# EAGLE design OV5640af (EAGLE 9.7.0)
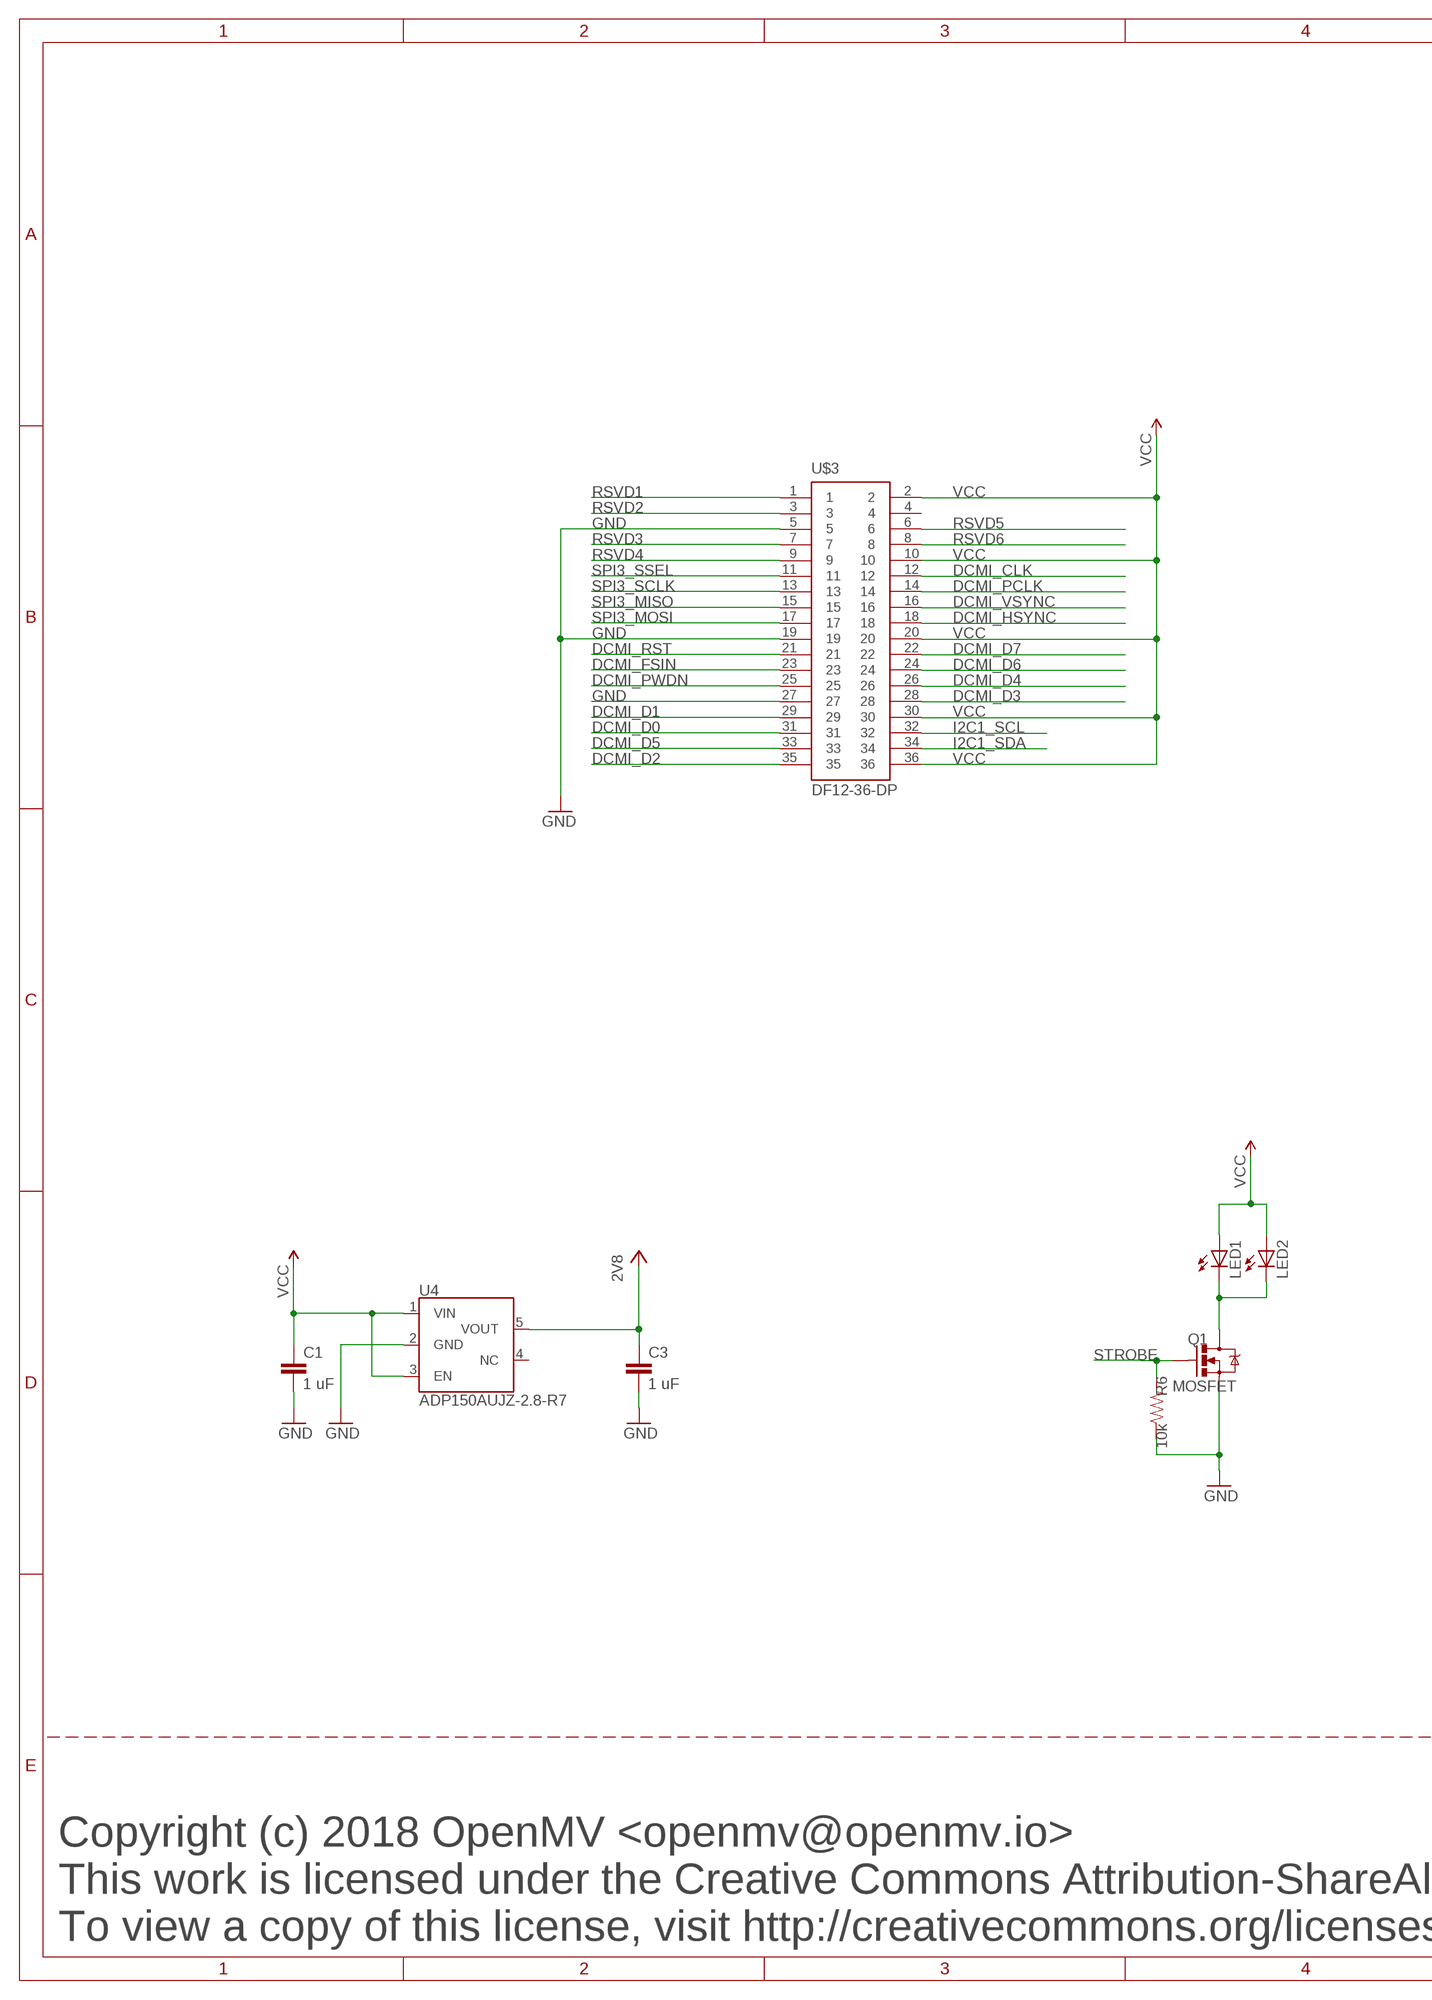
[diagram p0: schematic, sheet 1, part 1 of 2]
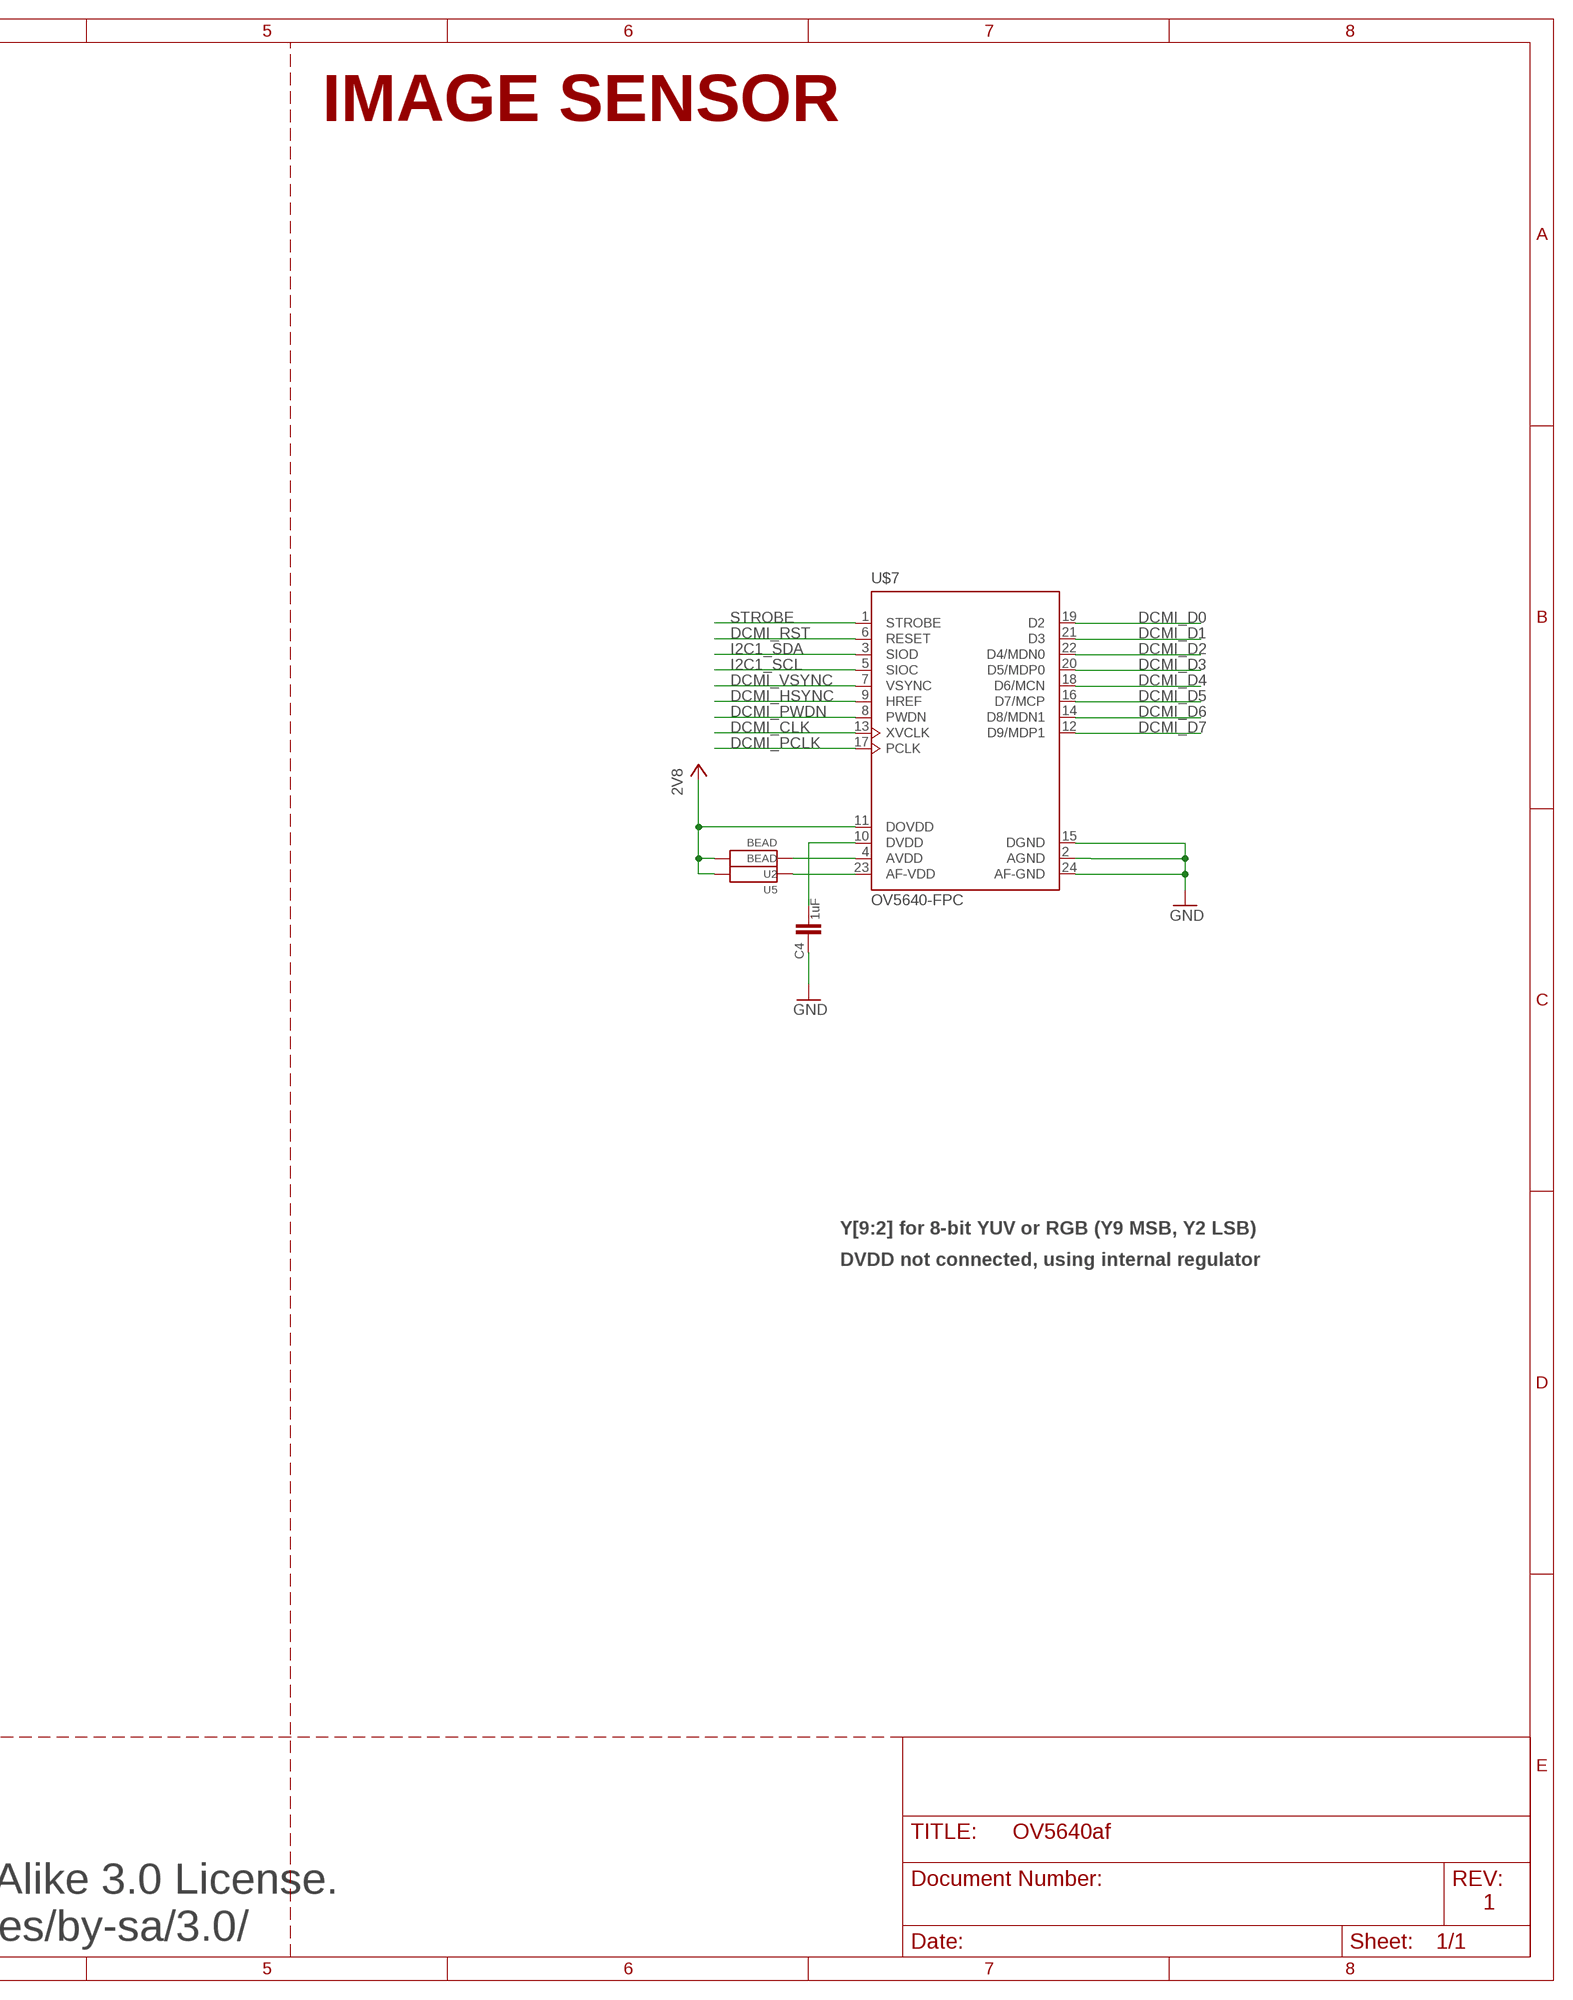
[diagram p1: schematic, sheet 1, part 2 of 2]

## Parts
C1  1 uF  CAP0402-CAP  [0402-CAP]
C3  1 uF  CAP0402-CAP  [0402-CAP]
C4  1uF  CAP0402-CAP  [0402-CAP]
LED1  LEDCHIPLED_1206  [CHIPLED_1206]
LED2  LEDCHIPLED_1206  [CHIPLED_1206]
Q1  MOSFET  MOSFET-NCHANNELSMD  [SOT23-3]
R6  10k  RESISTOR0603-RES  [0603-RES]
U2  BEAD  [0402-CAP]
U4  ADP150AUJZ-2.8-R7  ADP150TSOT-5  [SOT23-5]
U5  BEAD  [0402-CAP]
U$3  DF12-36-DP  [DF12-36-DP]
U$7  OV5640-FPC  [FPC24]

## Nets
2V8: C3.1 U2.2 U4.5(VOUT) U5.2 U$7.11(DOVDD)
AF-VDD: U5.1 U$7.23(AF-VDD)
AVDD: U2.1 U$7.4(AVDD)
DCMI_CLK: U$3.12 U$7.13(XVCLK)
DCMI_D0: U$3.31 U$7.19(D2)
DCMI_D1: U$3.29 U$7.21(D3)
DCMI_D2: U$3.35 U$7.22(D4/MDN0)
DCMI_D3: U$3.28 U$7.20(D5/MDP0)
DCMI_D4: U$3.26 U$7.18(D6/MCN)
DCMI_D5: U$3.33 U$7.16(D7/MCP)
DCMI_D6: U$3.24 U$7.14(D8/MDN1)
DCMI_D7: U$3.22 U$7.12(D9/MDP1)
DCMI_FSIN: U$3.23
DCMI_HSYNC: U$3.18 U$7.9(HREF)
DCMI_PCLK: U$3.14 U$7.17(PCLK)
DCMI_PWDN: U$3.25 U$7.8(PWDN)
DCMI_RST: U$3.21 U$7.6(RESET)
DCMI_VSYNC: U$3.16 U$7.7(VSYNC)
DVDD: C4.1 U$7.10(DVDD)
GND: C1.2 C3.2 C4.2 Q1.2(S) R6.1 U4.2(GND) U$3.5 U$3.19 U$3.27 U$7.2(AGND) U$7.15(DGND) U$7.24(AF-GND)
I2C1_SCL: U$3.32 U$7.5(SIOC)
I2C1_SDA: U$3.34 U$7.3(SIOD)
LEDK: LED1.C LED2.C Q1.3(D)
RSVD1: U$3.1
RSVD2: U$3.3
RSVD3: U$3.7
RSVD4: U$3.9
RSVD5: U$3.6
RSVD6: U$3.8
SPI3_MISO: U$3.15
SPI3_MOSI: U$3.17
SPI3_SCLK: U$3.13
SPI3_SSEL: U$3.11
STROBE: Q1.1(G) R6.2 U$7.1(STROBE)
VCC: C1.1 LED1.A LED2.A U4.1(VIN) U4.3(EN) U$3.2 U$3.10 U$3.20 U$3.30 U$3.36
Unconnected: U4.4(NC) U$3.4

## Notes on the sheet
- IMAGE SENSOR
- Y[9:2] for 8-bit YUV or RGB (Y9 MSB, Y2 LSB)
- DVDD not connected, using internal regulator
- Copyright (c) 2018 OpenMV <openmv@openmv.io>
- This work is licensed under the Creative Commons Attribution-ShareAlike 3.0 License.
- 1
- To view a copy of this license, visit http://creativecommons.org/licenses/by-sa/3.0/

## Library data of the parts
C1 C3 = SparkFun-Capacitors:CAP: Capacitor Standard 0603 ceramic capacitor, and 0.1" leaded capacitor.
C4 = sfe:CAP: Capacitor Standard 0603 ceramic capacitor, and 0.1" leaded capacitor.
LED1 LED2 = led:LED: LED OSRAM: - CHIPLED LG R971, LG N971, LY N971, LG Q971, LY Q971, LO R971, LY R971 LH N974, LH R974 LS Q976, LO Q976, LY Q976 LO Q996 - Hyper CHIPLED LW Q18S LB Q993, LB Q99A, LB R99A - SideLED LS A670, LO A670, LY A670, LG A670, LP A670 LB A673, LV A673, LT A673, LW A673 LH A674 LY A675 LS A676, LA A676, LO A676, LY A676, LW A676 LS A679, LY A679, LG A679 - Hyper Micro SIDELED® LS Y876, LA Y876, LO Y876, LY Y876 LT Y87S - SmartLED LW L88C, LW L88S LB L89C, LB L89S, LG L890 LS L89K, LO L89K, LY L89K LS L896, LA L896, LO L896, LY L896 - TOPLED LS T670, LO T670, LY T670, LG T670, LP T670 LSG T670, LSP T670, LSY T670, LOP T670, LYG T670 LG T671, LOG T671, LSG T671 LB T673, LV T673, LT T673, LW T673 LH T674 LS T676, LA T676, LO T676, LY T676, LB T676, LH T676, LSB T676, LW T676 LB T67C, LV T67C, LT T67C, LS T67K, LO T67K, LY T67K, LW E67C LS E67B, LA E67B, LO E67B, LY E67B, LB E67C, LV E67C, LT E67C LW T67C LS T679, LY T679, LG T679 LS T770, LO T770, LY T770, LG T770, LP T770 LB T773, LV T773, LT T773, LW T773 LH T774 LS E675, LA E675, LY E675, LS T675 LS T776, LA T776, LO T776, LY T776, LB T776 LHGB T686 LT T68C, LB T68C - Hyper Mini TOPLED® LB M676 - Mini TOPLED Santana® LG M470 LS M47K, LO M47K, LY M47K Source: http://www.osram.convergy.de LUXEON: - LUMILED® LXK2-PW12-R00, LXK2-PW12-S00, LXK2-PW14-U00, LXK2-PW14-V00 LXK2-PM12-R00, LXK2-PM12-S00, LXK2-PM14-U00 LXK2-PE12-Q00, LXK2-PE12-R00, LXK2-PE12-S00, LXK2-PE14-T00, LXK2-PE14-U00 LXK2-PB12-K00, LXK2-PB12-L00, LXK2-PB12-M00, LXK2-PB14-N00, LXK2-PB14-P00, LXK2-PB14-Q00 LXK2-PR12-L00, LXK2-PR12-M00, LXK2-PR14-Q00, LXK2-PR14-R00 LXK2-PD12-Q00, LXK2-PD12-R00, LXK2-PD12-S00 LXK2-PH12-R00, LXK2-PH12-S00 LXK2-PL12-P00, LXK2-PL12-Q00, LXK2-PL12-R00 Source: www.luxeon.com KINGBRIGHT: KA-3528ASYC Source: www.kingbright.com
Q1 = sfe:MOSFET-NCHANNEL
R6 = sfe:RESISTOR: Resistor Basic schematic elements and footprints for 0603, 1206, and PTH resistors.
U2 U5 = heka:BEAD
U4 = leptonCustom:ADP150: ADP150 2.8V 150mA Linear LDO Regulator Analog Devices ADP150AUJZ-2.8-R7
U$3 = DF12:DF12-36-DP
U$7 = ov5640:OV5640-FPC

## Net classes
0 default: width 0.127 mm

## Board
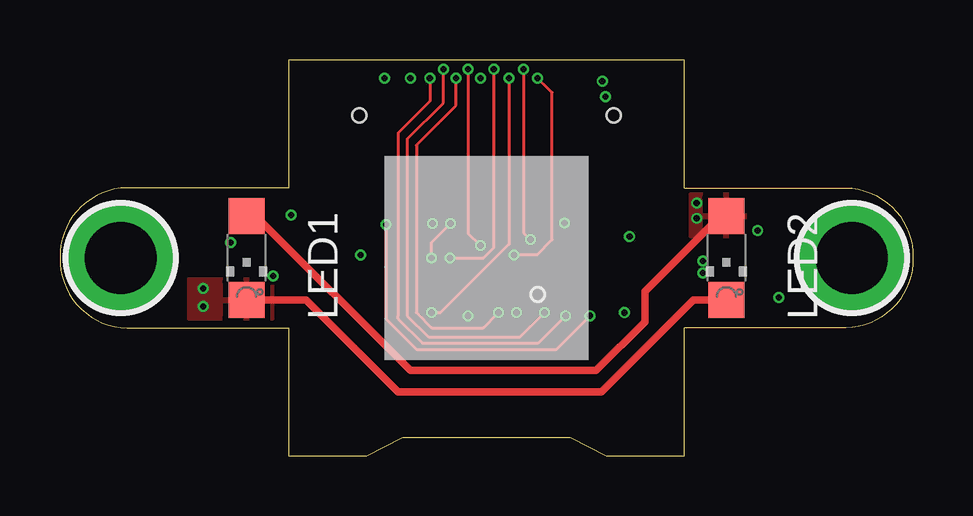
[diagram p2: board, top side]
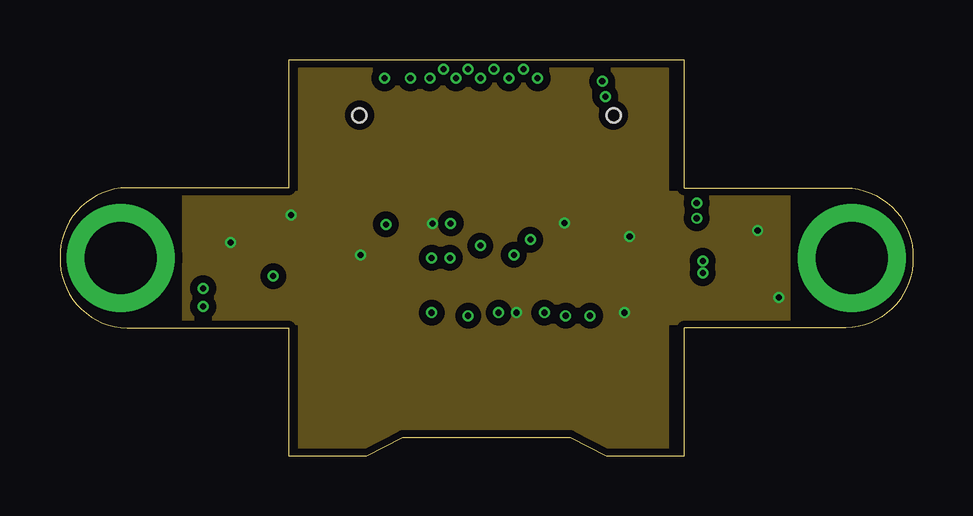
[diagram p3: board, inner layer GND]
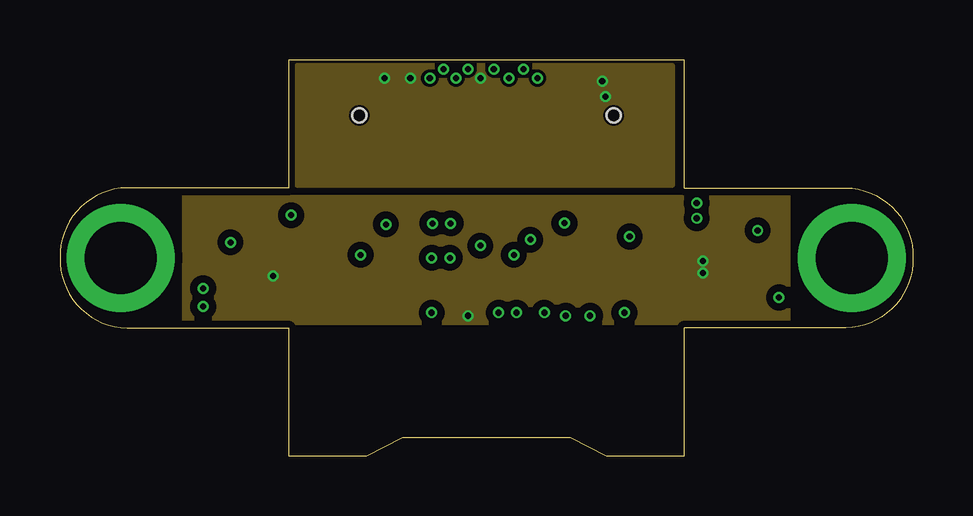
[diagram p4: board, inner layer VCC]
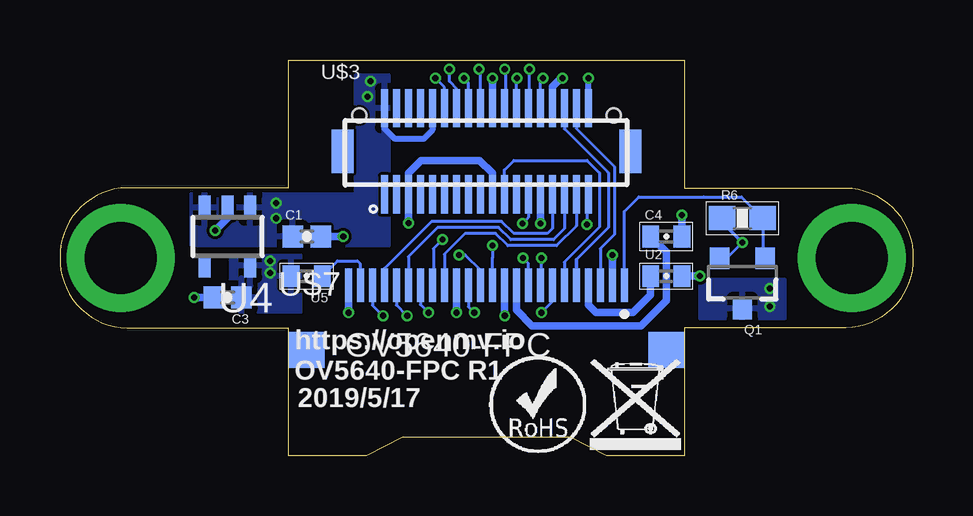
[diagram p5: board, bottom side, seen from below]

Size 35.56 x 16.51 mm. Coordinates in mm from the lower left corner, seen from the top.
Outline: 9.53,16.51 9.53,11.18 2.79,11.18 arc90 0,8.26 arc90 2.79,5.33 9.53,5.33 9.53,0 12.78,0 14.28,0.76 21.28,0.76 22.78,0 26.04,0 26.04,5.33 32.77,5.33 arc90 35.56,8.26 arc90 32.77,11.18 26.04,11.18 26.04,16.51 9.53,16.51
Copper layers (1*2+15*16): Top 0.035mm / dielectric 1.5mm / GND 0.035mm / dielectric 0.15mm / VCC 0.035mm / dielectric 0.2mm / Bottom 0.035mm
Design rules "default *": minimum track width 4mil, minimum drill 10mil, track to track 5mil, track to pad 5mil, pad to pad 5mil, via to via 5mil, smd to smd 5mil, copper to edge 5mil, drill to drill 10mil, minimum pad ring 10mil, minimum via ring 4mil, stop-mask expansion 2mil, vias tented up to drill 30mil, thermal gap 10mil

### Footprints (pad centres in the part's own frame; a part is rotated, then mirrored left to right if it is on the bottom)
0402-CAP = smd 0.85 x 0.9: 1 -0.58,0; 2 0.58,0
0402-CAP' = smd 0.7 x 0.9: 1 -0.65,0; 2 0.65,0
CHIPLED_1206 = smd 1.5 x 1.5: A 0,-1.75; C 0,1.75
SOT23-3 = smd 0.8 x 0.9: 1 -0.95,-1; 2 0.95,-1; 3 0,1.1
0603-RES = smd 1.1 x 1: 1 -0.85,0; 2 0.85,0
SOT23-5 = smd 0.5 x 1: 1 -0.95,-1.2; 2 0,-1.2; 3 0.95,-1.2; 4 0.95,1.2; 5 -0.95,1.2
DF12-36-DP = smd 0.3 x 1.6: 1 -4.25,-1.8; 2 -4.25,1.8; 3 -3.75,-1.8; 4 -3.75,1.8; 5 -3.25,-1.8; 6 -3.25,1.8; 7 -2.75,-1.8; 8 -2.75,1.8; 9 -2.25,-1.8; 10 -2.25,1.8; 11 -1.75,-1.8; 12 -1.75,1.8; 13 -1.25,-1.8; 14 -1.25,1.8; 15 -0.75,-1.8; 16 -0.75,1.8; 17 -0.25,-1.8; 18 -0.25,1.8; 19 0.25,-1.8; 20 0.25,1.8; 21 0.75,-1.8; 22 0.75,1.8; 23 1.25,-1.8; 24 1.25,1.8; 25 1.75,-1.8; 26 1.75,1.8; 27 2.25,-1.8; 28 2.25,1.8; 29 2.75,-1.8; 30 2.75,1.8; 31 3.25,-1.8; 32 3.25,1.8; 33 3.75,-1.8; 34 3.75,1.8; 35 4.25,-1.8; 36 4.25,1.8 | smd 0.9 x 1.8: F1 -6,0; F2 6,0 | hole 0.6: -5.3,1.5; 5.3,1.5
FPC24 = smd 0.3 x 1.4: 1 -5.75,0; 2 -5.25,0; 3 -4.75,0; 4 -4.25,0; 5 -3.75,0; 6 -3.25,0; 7 -2.75,0; 8 -2.25,0; 9 -1.75,0; 10 -1.25,0; 11 -0.75,0; 12 -0.25,0; 13 0.25,0; 14 0.75,0; 15 1.25,0; 16 1.75,0; 17 2.25,0; 18 2.75,0; 19 3.25,0; 20 3.75,0; 21 4.25,0; 22 4.75,0; 23 5.25,0; 24 5.75,0 | smd 1.5 x 1.5: PAD1 -7.5,2.7; PAD2 7.5,2.7

### Placement (x,y rotation side)
C1  25.27,9.14 0 bottom
C3  28.58,6.6 180 bottom
C4  1uF  [0402-CAP']  10.29,9.14 0 bottom
LED1  7.78,8.26 180 top
LED2  27.78,8.26 180 top
Q1  7.11,7.24 180 bottom
R6  7.11,9.91 0 bottom
U2  BEAD  [0402-CAP']  10.29,7.49 0 bottom
U4  28.58,9.14 180 bottom
U5  BEAD  [0402-CAP']  25.27,7.49 180 bottom
U$1  [WEEE]  13.46,0.25 0 bottom
U$2  [ROHS]  17.65,0.13 0 bottom
U$3  17.78,12.7 0 bottom
U$7  17.78,7.11 180 bottom

### Tracks (layer width: path | path; a pad name or v marks a point on that pad's centre or on a via)
2V8  (via drill 0.25)
  Bottom 0.127: 17.03,5.85 v17.02,5.84
  Bottom 0.305: U$7.11 17.03,5.85 | U2.2 v8.89,7.49
  other vias: 26.8,7.62 26.8,8.13
  pour VCC (isolate 0.305, rank 2): 5.21,5.59 30.35,5.59 30.35,10.92 5.21,10.92
  pour Bottom: 25.53,5.97 28.45,5.97 28.45,8.38 25.53,8.38
AF-VDD
  Bottom 0.127: U$7.23 23.03,8 23.16,8.13 23.99,8.13 U5.1
AVDD
  Bottom 0.127: 11.68,5.97 10.94,6.72
  Bottom 0.305: U$7.4 13.53,6.29 13.21,5.97 11.68,5.97 10.94,6.72 U2.1
DCMI_CLK  (via drill 0.25)
  Top 0.127: v18.92,8.38 19.88,8.38 20.51,9.02 20.51,15.15 v19.91,15.75
  Bottom 0.127: U$7.13 18.03,7.74 18.67,8.38 v18.92,8.38 | U$3.12 19.53,15.36 v19.91,15.75
DCMI_D0
  Bottom 0.127: U$3.31 14.53,9.47 14.99,9.02 16.76,9.02 17.27,9.53 19.81,9.53 21.03,8.31 U$7.19
DCMI_D1
  Bottom 0.127: U$3.29 15.03,9.48 15.24,9.27 16.64,9.27 17.14,9.78 20.07,9.78 22.03,7.82 U$7.21
DCMI_D2  (via drill 0.25)
  Top 0.127: v13.59,9.65 13.59,7.87 13.59,5.71 14.86,4.45 20.7,4.45 v22.1,5.84
  Bottom 0.127: U$3.35 13.59,10.84 v13.59,9.65 | v22.1,5.84 22.53,6.27 U$7.22
DCMI_D3  (via drill 0.25)
  Top 0.127: v15.42,15.75 15.42,14.78 14.1,13.46 14.1,7.75 14.1,5.97 14.1,5.84 14.1,5.71 15.11,4.7 19.94,4.7 v21.08,5.84
  Bottom 0.127: U$3.28 15.53,15.64 v15.42,15.75 | v21.08,5.84 21.53,6.29 U$7.20
DCMI_D4  (via drill 0.25)
  Top 0.127: v20.19,5.97 19.18,4.95 16,4.95 15.37,4.95 14.48,5.84 14.48,7.62 14.48,13.21 15.98,14.71 v15.98,16.13
  Bottom 0.127: U$3.26 15.98,14.55 v15.98,16.13 | v20.19,5.97 20.53,6.31 U$7.18
DCMI_D5
  Bottom 0.127: U$3.33 14.03,9.59 14.86,8.76 16.89,8.76 17.4,9.27 18.67,9.27 19.53,8.41 U$7.16
DCMI_D6  (via drill 0.25)
  Top 0.127: v18.29,5.97 17.65,5.33 15.49,5.33 14.86,5.97 14.86,12.95 16.51,14.61 v16.51,15.75
  Bottom 0.127: U$3.24 16.53,15.73 v16.51,15.75 | v18.29,5.97 18.53,6.21 U$7.14
DCMI_D7  (via drill 0.25)
  Top 0.127: v17.53,8.76 17.02,9.27 17.02,13.08 v17.02,16.13
  Bottom 0.127: U$3.22 17,14.53 17,16.11 v17.02,16.13 | U$7.12 17.53,8.26 v17.53,8.76
DCMI_HSYNC  (via drill 0.25)
  Top 0.127: v16.26,8.26 17.65,8.26 18.09,8.69 v18.09,16.13
  Bottom 0.127: v16.26,8.26 16.03,8.03 U$7.9 | U$3.18 18.03,16.07 v18.09,16.13
DCMI_PCLK  (via drill 0.25)
  Top 0.127: v19.33,16.13 19.33,9.3 v19.61,9.02
  Bottom 0.127: U$7.17 19.99,7.15 19.99,8.64 v19.61,9.02 | U$3.14 19.03,15.32 19.33,15.62 v19.33,16.13
DCMI_PWDN  (via drill 0.25)
  Top 0.127: v15.49,8.26 15.49,8.9 v16.28,9.69
  Bottom 0.127: v16.28,9.69 16.03,9.94 U$3.25 | U$7.8 15.5,7.14 15.5,7.76 15.49,7.77 v15.49,8.26
DCMI_RST
  Bottom 0.127: U$3.21 17.03,11.93 16.64,12.32 13.59,12.32 13.06,11.79 13.06,9.54 14.53,8.08 U$7.6
DCMI_VSYNC  (via drill 0.25)
  Top 0.127: v15.49,5.97 15.86,5.97 18.72,8.83 v18.72,15.75
  Bottom 0.127: U$7.7 15.03,6.43 v15.49,5.97 | U$3.16 18.53,15.56 v18.72,15.75
DVDD
  Bottom 0.127: 11.72,5.42 13.46,5.42 15.88,5.42 | 10.29,8.49 10.29,7.49 10.29,6.86 | 10.29,6.48 11.34,5.42
  Bottom 0.305: U$7.10 16.53,6.08 15.88,5.42 11.72,5.42 11.34,5.42 10.29,6.48 10.29,6.86 10.29,8.49 C4.1
GND  (via drill 0.25)
  Bottom 0.127: v9.64,10.03 9.64,9.69 | Q1.2 7.77,8.24 v7.11,8.9
  Bottom 0.152: R6.1 7.96,9.75 v7.11,8.9
  Bottom 0.305: v21.03,9.7 U$3.5 21.03,11.79 20.5,12.32 18.06,12.32 17.53,11.79 U$3.19 | U$7.2 v12.53,8.38 | U$3.27 v15.53,9.69 | U$7.15 v19.03,5.97 | U$7.24 v23.53,5.97 | C1.2 v23.75,9.14 | v29.08,9.4 28.58,9.91 U4.2 | C3.2 v29.97,6.6 | v9.64,10.03 C4.2
  pour GND (isolate 0.305): 10.01,5.53 10.03,5.49 10.03,0.13 25.27,0.13 25.27,5.49 25.29,5.53 25.33,5.57 25.37,5.59 30.35,5.59 30.35,10.92 25.37,10.92 25.33,10.94 25.29,10.98 25.27,11.02 25.27,16.13 10.03,16.13 10.03,11.02 10.01,10.98 9.98,10.94 9.93,10.92 5.21,10.92 5.21,5.59 9.93,5.59 9.98,5.57
I2C1_SCL
  Bottom 0.127: U$3.32 14.53,13.64 12.7,11.81 12.7,9.53 14.03,8.2
  Bottom 0.152: U$7.5 14.03,7.69 14.03,8.2
I2C1_SDA
  Bottom 0.127: U$3.34 14.03,13.65 12.45,12.06 12.45,9.22 13.03,8.64 U$7.3
LEDK  (via drill 0.25)
  Top 0.305: LED2.C 26.42,6.5 22.58,2.67 22.35,2.67 14.1,2.67 10.48,6.29 10.26,6.5 LED1.C
  other vias: 5.97,6.22 5.97,6.99
  pour Bottom: 5.33,5.71 8.89,5.71 8.89,7.37 5.33,7.37
  pour Top: 5.33,5.71 8.89,5.71 8.89,7.37 5.33,7.37
N$2  (via drill 3 pad 4.5)
  other vias: 2.54,8.26
N$4  (via drill 3 pad 4.5)
  other vias: 33.02,8.26
STROBE
  Bottom 0.127: U$7.1 12.03,10.2 11.43,10.79 8.72,10.79 7.15,10.79 R6.2 6.26,8.34 Q1.1
VCC  (via drill 0.25)
  Top 0.305: LED2.A 27.53,10.01 24.38,6.86 24.38,5.59 22.35,3.56 14.61,3.56 8.16,10.01 LED1.A
  Bottom 0.254: U$3.36 13.53,15.69 v13.53,15.75 | U$3.10 20.03,13.59 20.41,13.21 21.59,13.21 22.03,13.65 U$3.2
  Bottom 0.305: U$3.30 15.03,15.39 14.67,15.75 v14.61,15.75 | U$3.20 v17.53,15.74 v17.53,15.75
  other vias: 22.61,15.62 22.73,14.99 26.54,10.54 26.54,9.91
  pour VCC: 9.91,11.3 25.53,11.3 25.53,16.26 9.91,16.26
  pour Bottom: 30.1,8.76 30.1,10.92 23.3,10.92 23.27,10.93 23.25,10.96 23.24,10.98 23.24,15.88 21.84,15.88 21.84,8.76
  pour Top: 26.29,9.14 28.58,9.14 28.58,10.92 26.29,10.92

### Text on the board
bPlace: https://openmv.io | OV5640-FPC R1 | 2019/5/17